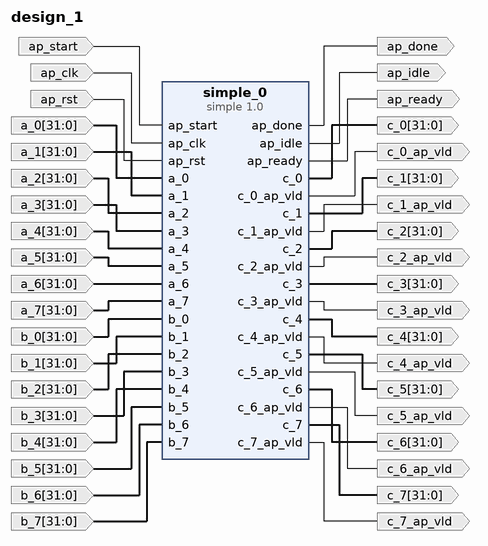
[diagram p0: block diagram of the top level]
# Vivado block design design_1, xcku035-ffva1156-3-e, Vivado 2017.2
create_bd_design design_1

create_bd_port -dir I ap_start
create_bd_port -dir O ap_done
create_bd_port -dir O ap_idle
create_bd_port -dir O ap_ready
create_bd_port -dir I -type clk ap_clk
set_property -dict {CONFIG.FREQ_HZ 100000000} [get_bd_ports ap_clk]
create_bd_port -dir I -type rst ap_rst
set_property -dict {CONFIG.POLARITY ACTIVE_HIGH} [get_bd_ports ap_rst]
create_bd_port -dir I -from 31 -to 0 -type data a_0
set_property -dict [list \
  CONFIG.LAYERED_METADATA {xilinx.com:interface:datatypes:1.0 {DATA {datatype {name {attribs {resolve_type immediate dependency {} format string minimum {} maximum {}} value {}} bitwidth {attribs {resolve_type immediate dependency {} format long minimum {} maximum {}} value 32} bitoffset {attribs {resolve_type immediate dependency {} format long minimum {} maximum {}} value 0} real {float {sigwidth {attribs {resolve_type immediate dependency {} format long minimum {} maximum {}} value 24}}}}}}} \
] [get_bd_ports a_0]
create_bd_port -dir I -from 31 -to 0 -type data a_1
set_property -dict [list \
  CONFIG.LAYERED_METADATA {xilinx.com:interface:datatypes:1.0 {DATA {datatype {name {attribs {resolve_type immediate dependency {} format string minimum {} maximum {}} value {}} bitwidth {attribs {resolve_type immediate dependency {} format long minimum {} maximum {}} value 32} bitoffset {attribs {resolve_type immediate dependency {} format long minimum {} maximum {}} value 0} real {float {sigwidth {attribs {resolve_type immediate dependency {} format long minimum {} maximum {}} value 24}}}}}}} \
] [get_bd_ports a_1]
create_bd_port -dir I -from 31 -to 0 -type data a_2
set_property -dict [list \
  CONFIG.LAYERED_METADATA {xilinx.com:interface:datatypes:1.0 {DATA {datatype {name {attribs {resolve_type immediate dependency {} format string minimum {} maximum {}} value {}} bitwidth {attribs {resolve_type immediate dependency {} format long minimum {} maximum {}} value 32} bitoffset {attribs {resolve_type immediate dependency {} format long minimum {} maximum {}} value 0} real {float {sigwidth {attribs {resolve_type immediate dependency {} format long minimum {} maximum {}} value 24}}}}}}} \
] [get_bd_ports a_2]
create_bd_port -dir I -from 31 -to 0 -type data a_3
set_property -dict [list \
  CONFIG.LAYERED_METADATA {xilinx.com:interface:datatypes:1.0 {DATA {datatype {name {attribs {resolve_type immediate dependency {} format string minimum {} maximum {}} value {}} bitwidth {attribs {resolve_type immediate dependency {} format long minimum {} maximum {}} value 32} bitoffset {attribs {resolve_type immediate dependency {} format long minimum {} maximum {}} value 0} real {float {sigwidth {attribs {resolve_type immediate dependency {} format long minimum {} maximum {}} value 24}}}}}}} \
] [get_bd_ports a_3]
create_bd_port -dir I -from 31 -to 0 -type data a_4
set_property -dict [list \
  CONFIG.LAYERED_METADATA {xilinx.com:interface:datatypes:1.0 {DATA {datatype {name {attribs {resolve_type immediate dependency {} format string minimum {} maximum {}} value {}} bitwidth {attribs {resolve_type immediate dependency {} format long minimum {} maximum {}} value 32} bitoffset {attribs {resolve_type immediate dependency {} format long minimum {} maximum {}} value 0} real {float {sigwidth {attribs {resolve_type immediate dependency {} format long minimum {} maximum {}} value 24}}}}}}} \
] [get_bd_ports a_4]
create_bd_port -dir I -from 31 -to 0 -type data a_5
set_property -dict [list \
  CONFIG.LAYERED_METADATA {xilinx.com:interface:datatypes:1.0 {DATA {datatype {name {attribs {resolve_type immediate dependency {} format string minimum {} maximum {}} value {}} bitwidth {attribs {resolve_type immediate dependency {} format long minimum {} maximum {}} value 32} bitoffset {attribs {resolve_type immediate dependency {} format long minimum {} maximum {}} value 0} real {float {sigwidth {attribs {resolve_type immediate dependency {} format long minimum {} maximum {}} value 24}}}}}}} \
] [get_bd_ports a_5]
create_bd_port -dir I -from 31 -to 0 -type data a_6
set_property -dict [list \
  CONFIG.LAYERED_METADATA {xilinx.com:interface:datatypes:1.0 {DATA {datatype {name {attribs {resolve_type immediate dependency {} format string minimum {} maximum {}} value {}} bitwidth {attribs {resolve_type immediate dependency {} format long minimum {} maximum {}} value 32} bitoffset {attribs {resolve_type immediate dependency {} format long minimum {} maximum {}} value 0} real {float {sigwidth {attribs {resolve_type immediate dependency {} format long minimum {} maximum {}} value 24}}}}}}} \
] [get_bd_ports a_6]
create_bd_port -dir I -from 31 -to 0 -type data a_7
set_property -dict [list \
  CONFIG.LAYERED_METADATA {xilinx.com:interface:datatypes:1.0 {DATA {datatype {name {attribs {resolve_type immediate dependency {} format string minimum {} maximum {}} value {}} bitwidth {attribs {resolve_type immediate dependency {} format long minimum {} maximum {}} value 32} bitoffset {attribs {resolve_type immediate dependency {} format long minimum {} maximum {}} value 0} real {float {sigwidth {attribs {resolve_type immediate dependency {} format long minimum {} maximum {}} value 24}}}}}}} \
] [get_bd_ports a_7]
create_bd_port -dir I -from 31 -to 0 -type data b_0
set_property -dict [list \
  CONFIG.LAYERED_METADATA {xilinx.com:interface:datatypes:1.0 {DATA {datatype {name {attribs {resolve_type immediate dependency {} format string minimum {} maximum {}} value {}} bitwidth {attribs {resolve_type immediate dependency {} format long minimum {} maximum {}} value 32} bitoffset {attribs {resolve_type immediate dependency {} format long minimum {} maximum {}} value 0} real {float {sigwidth {attribs {resolve_type immediate dependency {} format long minimum {} maximum {}} value 24}}}}}}} \
] [get_bd_ports b_0]
create_bd_port -dir I -from 31 -to 0 -type data b_1
set_property -dict [list \
  CONFIG.LAYERED_METADATA {xilinx.com:interface:datatypes:1.0 {DATA {datatype {name {attribs {resolve_type immediate dependency {} format string minimum {} maximum {}} value {}} bitwidth {attribs {resolve_type immediate dependency {} format long minimum {} maximum {}} value 32} bitoffset {attribs {resolve_type immediate dependency {} format long minimum {} maximum {}} value 0} real {float {sigwidth {attribs {resolve_type immediate dependency {} format long minimum {} maximum {}} value 24}}}}}}} \
] [get_bd_ports b_1]
create_bd_port -dir I -from 31 -to 0 -type data b_2
set_property -dict [list \
  CONFIG.LAYERED_METADATA {xilinx.com:interface:datatypes:1.0 {DATA {datatype {name {attribs {resolve_type immediate dependency {} format string minimum {} maximum {}} value {}} bitwidth {attribs {resolve_type immediate dependency {} format long minimum {} maximum {}} value 32} bitoffset {attribs {resolve_type immediate dependency {} format long minimum {} maximum {}} value 0} real {float {sigwidth {attribs {resolve_type immediate dependency {} format long minimum {} maximum {}} value 24}}}}}}} \
] [get_bd_ports b_2]
create_bd_port -dir I -from 31 -to 0 -type data b_3
set_property -dict [list \
  CONFIG.LAYERED_METADATA {xilinx.com:interface:datatypes:1.0 {DATA {datatype {name {attribs {resolve_type immediate dependency {} format string minimum {} maximum {}} value {}} bitwidth {attribs {resolve_type immediate dependency {} format long minimum {} maximum {}} value 32} bitoffset {attribs {resolve_type immediate dependency {} format long minimum {} maximum {}} value 0} real {float {sigwidth {attribs {resolve_type immediate dependency {} format long minimum {} maximum {}} value 24}}}}}}} \
] [get_bd_ports b_3]
create_bd_port -dir I -from 31 -to 0 -type data b_4
set_property -dict [list \
  CONFIG.LAYERED_METADATA {xilinx.com:interface:datatypes:1.0 {DATA {datatype {name {attribs {resolve_type immediate dependency {} format string minimum {} maximum {}} value {}} bitwidth {attribs {resolve_type immediate dependency {} format long minimum {} maximum {}} value 32} bitoffset {attribs {resolve_type immediate dependency {} format long minimum {} maximum {}} value 0} real {float {sigwidth {attribs {resolve_type immediate dependency {} format long minimum {} maximum {}} value 24}}}}}}} \
] [get_bd_ports b_4]
create_bd_port -dir I -from 31 -to 0 -type data b_5
set_property -dict [list \
  CONFIG.LAYERED_METADATA {xilinx.com:interface:datatypes:1.0 {DATA {datatype {name {attribs {resolve_type immediate dependency {} format string minimum {} maximum {}} value {}} bitwidth {attribs {resolve_type immediate dependency {} format long minimum {} maximum {}} value 32} bitoffset {attribs {resolve_type immediate dependency {} format long minimum {} maximum {}} value 0} real {float {sigwidth {attribs {resolve_type immediate dependency {} format long minimum {} maximum {}} value 24}}}}}}} \
] [get_bd_ports b_5]
create_bd_port -dir I -from 31 -to 0 -type data b_6
set_property -dict [list \
  CONFIG.LAYERED_METADATA {xilinx.com:interface:datatypes:1.0 {DATA {datatype {name {attribs {resolve_type immediate dependency {} format string minimum {} maximum {}} value {}} bitwidth {attribs {resolve_type immediate dependency {} format long minimum {} maximum {}} value 32} bitoffset {attribs {resolve_type immediate dependency {} format long minimum {} maximum {}} value 0} real {float {sigwidth {attribs {resolve_type immediate dependency {} format long minimum {} maximum {}} value 24}}}}}}} \
] [get_bd_ports b_6]
create_bd_port -dir I -from 31 -to 0 -type data b_7
set_property -dict [list \
  CONFIG.LAYERED_METADATA {xilinx.com:interface:datatypes:1.0 {DATA {datatype {name {attribs {resolve_type immediate dependency {} format string minimum {} maximum {}} value {}} bitwidth {attribs {resolve_type immediate dependency {} format long minimum {} maximum {}} value 32} bitoffset {attribs {resolve_type immediate dependency {} format long minimum {} maximum {}} value 0} real {float {sigwidth {attribs {resolve_type immediate dependency {} format long minimum {} maximum {}} value 24}}}}}}} \
] [get_bd_ports b_7]
create_bd_port -dir O -from 31 -to 0 -type data c_7
create_bd_port -dir O -from 31 -to 0 -type data c_6
create_bd_port -dir O -from 31 -to 0 -type data c_5
create_bd_port -dir O -from 31 -to 0 -type data c_4
create_bd_port -dir O -from 31 -to 0 -type data c_3
create_bd_port -dir O -from 31 -to 0 -type data c_2
create_bd_port -dir O -from 31 -to 0 -type data c_1
create_bd_port -dir O -from 31 -to 0 -type data c_0
create_bd_port -dir O c_0_ap_vld
create_bd_port -dir O c_1_ap_vld
create_bd_port -dir O c_2_ap_vld
create_bd_port -dir O c_3_ap_vld
create_bd_port -dir O c_4_ap_vld
create_bd_port -dir O c_5_ap_vld
create_bd_port -dir O c_6_ap_vld
create_bd_port -dir O c_7_ap_vld

create_bd_cell -type ip -vlnv xilinx.com:hls:simple:1.0 simple_0

# ---- connections ----

connect_bd_net [get_bd_ports ap_start] [get_bd_pins simple_0/ap_start]
connect_bd_net [get_bd_pins simple_0/ap_done] [get_bd_ports ap_done]
connect_bd_net [get_bd_pins simple_0/ap_idle] [get_bd_ports ap_idle]
connect_bd_net [get_bd_pins simple_0/ap_ready] [get_bd_ports ap_ready]
connect_bd_net [get_bd_ports ap_clk] [get_bd_pins simple_0/ap_clk]
connect_bd_net [get_bd_ports ap_rst] [get_bd_pins simple_0/ap_rst]
connect_bd_net -net a_0_1 [get_bd_ports a_0] [get_bd_pins simple_0/a_0]
connect_bd_net -net a_1_1 [get_bd_ports a_1] [get_bd_pins simple_0/a_1]
connect_bd_net -net a_2_1 [get_bd_ports a_2] [get_bd_pins simple_0/a_2]
connect_bd_net -net a_3_1 [get_bd_ports a_3] [get_bd_pins simple_0/a_3]
connect_bd_net -net a_4_1 [get_bd_ports a_4] [get_bd_pins simple_0/a_4]
connect_bd_net -net a_5_1 [get_bd_ports a_5] [get_bd_pins simple_0/a_5]
connect_bd_net -net a_6_1 [get_bd_ports a_6] [get_bd_pins simple_0/a_6]
connect_bd_net -net a_7_1 [get_bd_ports a_7] [get_bd_pins simple_0/a_7]
connect_bd_net -net b_0_1 [get_bd_ports b_0] [get_bd_pins simple_0/b_0]
connect_bd_net -net b_1_1 [get_bd_ports b_1] [get_bd_pins simple_0/b_1]
connect_bd_net -net b_2_1 [get_bd_ports b_2] [get_bd_pins simple_0/b_2]
connect_bd_net -net b_3_1 [get_bd_ports b_3] [get_bd_pins simple_0/b_3]
connect_bd_net -net b_4_1 [get_bd_ports b_4] [get_bd_pins simple_0/b_4]
connect_bd_net -net b_5_1 [get_bd_ports b_5] [get_bd_pins simple_0/b_5]
connect_bd_net -net b_6_1 [get_bd_ports b_6] [get_bd_pins simple_0/b_6]
connect_bd_net -net b_7_1 [get_bd_ports b_7] [get_bd_pins simple_0/b_7]
connect_bd_net [get_bd_pins simple_0/c_7] [get_bd_ports c_7]
connect_bd_net [get_bd_pins simple_0/c_6] [get_bd_ports c_6]
connect_bd_net [get_bd_pins simple_0/c_5] [get_bd_ports c_5]
connect_bd_net [get_bd_pins simple_0/c_4] [get_bd_ports c_4]
connect_bd_net [get_bd_pins simple_0/c_3] [get_bd_ports c_3]
connect_bd_net [get_bd_pins simple_0/c_2] [get_bd_ports c_2]
connect_bd_net [get_bd_pins simple_0/c_1] [get_bd_ports c_1]
connect_bd_net [get_bd_pins simple_0/c_0] [get_bd_ports c_0]
connect_bd_net [get_bd_pins simple_0/c_0_ap_vld] [get_bd_ports c_0_ap_vld]
connect_bd_net [get_bd_pins simple_0/c_1_ap_vld] [get_bd_ports c_1_ap_vld]
connect_bd_net [get_bd_pins simple_0/c_2_ap_vld] [get_bd_ports c_2_ap_vld]
connect_bd_net [get_bd_pins simple_0/c_3_ap_vld] [get_bd_ports c_3_ap_vld]
connect_bd_net [get_bd_pins simple_0/c_4_ap_vld] [get_bd_ports c_4_ap_vld]
connect_bd_net [get_bd_pins simple_0/c_5_ap_vld] [get_bd_ports c_5_ap_vld]
connect_bd_net [get_bd_pins simple_0/c_6_ap_vld] [get_bd_ports c_6_ap_vld]
connect_bd_net [get_bd_pins simple_0/c_7_ap_vld] [get_bd_ports c_7_ap_vld]

validate_bd_design
save_bd_design
